# Altium schematic sheet Block Diagram.SchDoc: [2] Block Diagram
size A3; Revision: 1.0; SheetNumber: 2; SheetTotal: 24
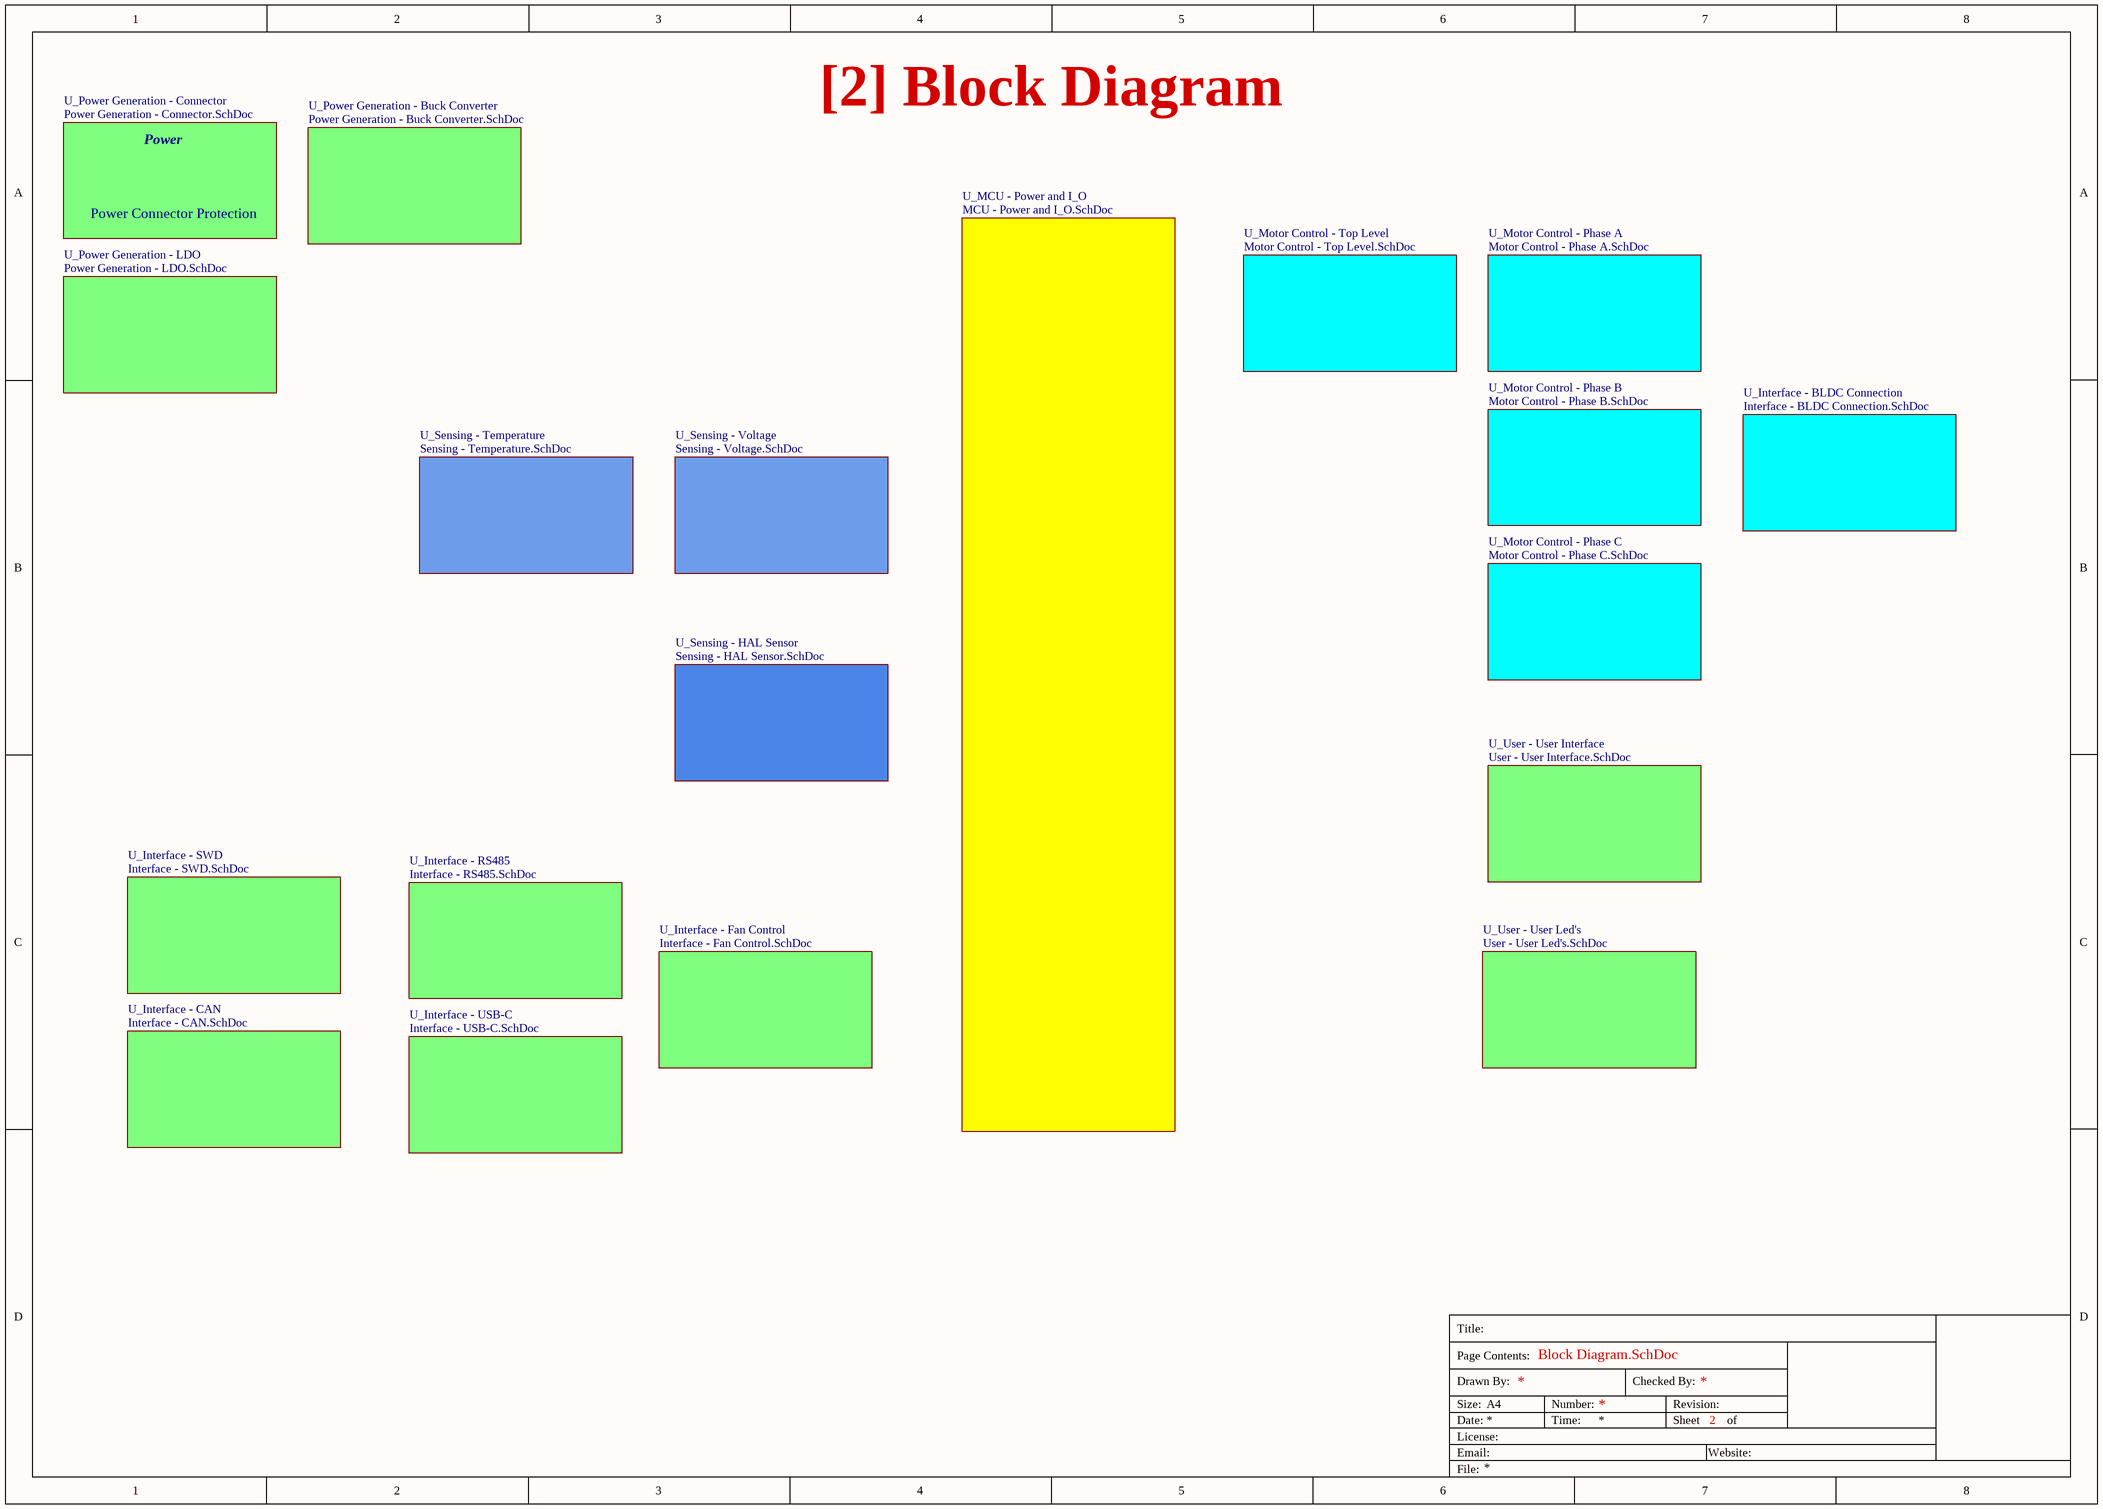
[diagram p0: Block Diagram.SchDoc]

## Sub-sheets
U_Interface - BLDC Connection = Interface - BLDC Connection.SchDoc: no entries
U_Interface - CAN = Interface - CAN.SchDoc: no entries
U_Interface - Fan Control = Interface - Fan Control.SchDoc: no entries
U_Interface - RS485 = Interface - RS485.SchDoc: no entries
U_Interface - SWD = Interface - SWD.SchDoc: no entries
U_Interface - USB-C = Interface - USB-C.SchDoc: no entries
U_MCU - Power and I_O = MCU - Power and I_O.SchDoc: no entries
U_Motor Control - Phase A = Motor Control - Phase A.SchDoc: no entries
U_Motor Control - Phase B = Motor Control - Phase B.SchDoc: no entries
U_Motor Control - Phase C = Motor Control - Phase C.SchDoc: no entries
U_Motor Control - Top Level = Motor Control - Top Level.SchDoc: no entries
U_Power Generation - Buck Converter = Power Generation - Buck Converter.SchDoc: no entries
U_Power Generation - Connector = Power Generation - Connector.SchDoc: no entries
U_Power Generation - LDO = Power Generation - LDO.SchDoc: no entries
U_Sensing - HAL Sensor = Sensing - HAL Sensor.SchDoc: no entries
U_Sensing - Temperature = Sensing - Temperature.SchDoc: no entries
U_Sensing - Voltage = Sensing - Voltage.SchDoc: no entries
U_User - User Interface = User - User Interface.SchDoc: no entries
U_User - User Led's = User - User Led's.SchDoc: no entries

## Notes on the sheet
- Power
- Power Connector Protection
- Title:
- Drawn By:
- Page Contents:
- Checked By:
- Size:
- Date:
- File:
- License:
- Email:
- A4
- Number:
- Time:
- Revision:
- Sheet
- Website:
- of